# Altium schematic sheet Sheet1.SchDoc
size A
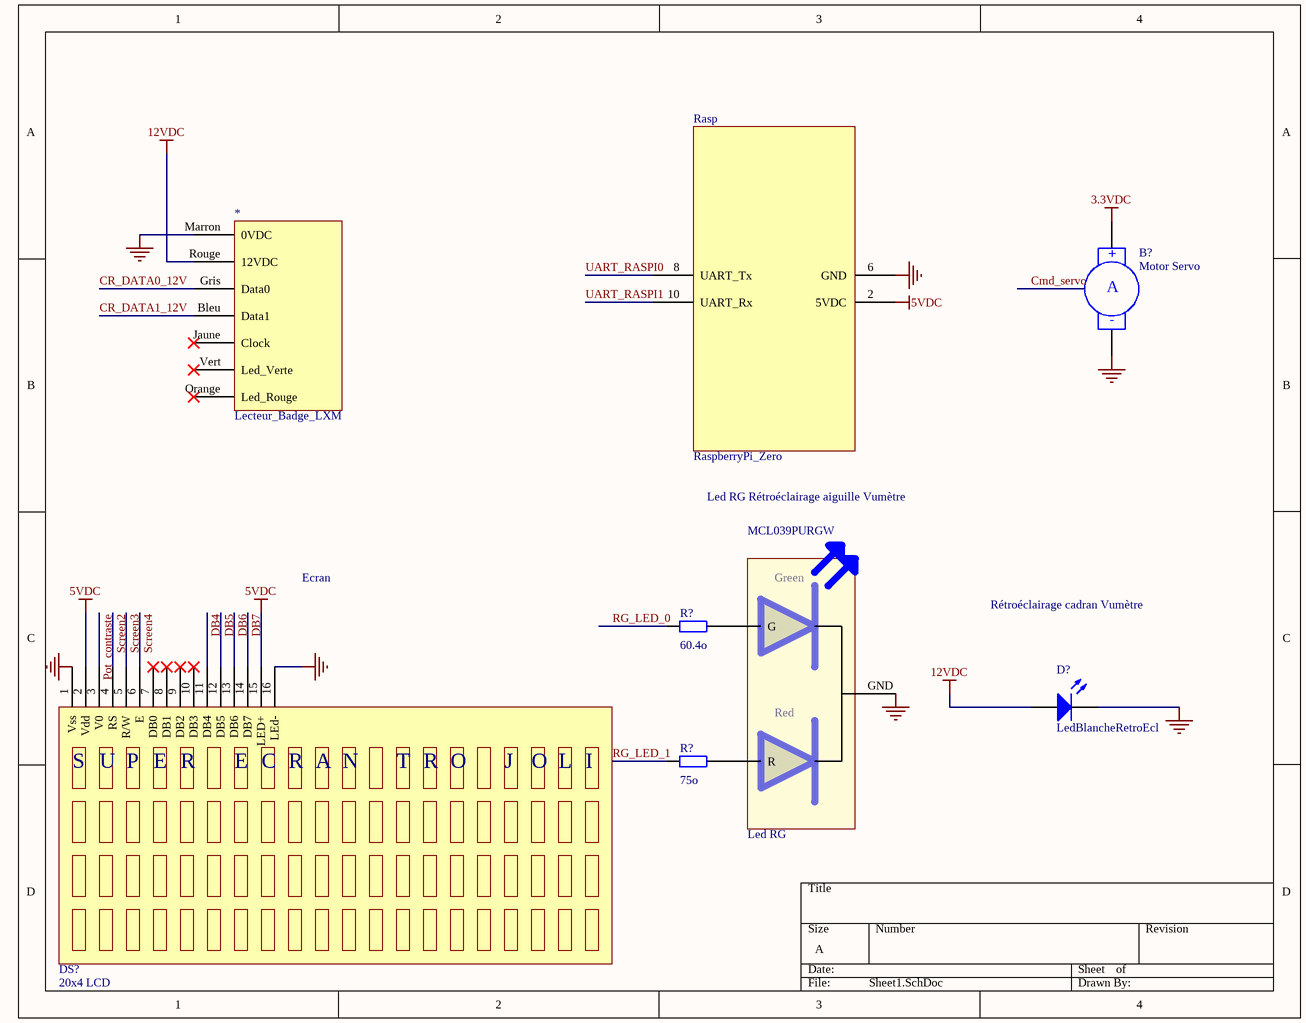
[diagram p0: Sheet1.SchDoc]

## Parts
(Parts that share a designator on the sheet are numbered #1, #2 ... from top to bottom, then left to right.)
*  Lecteur_Badge_LXM
B?  Motor Servo  [RAD-0.4]
D?  LedBlancheRetroEcl  [LED-0]
DS?  20x4 LCD
MCL039PURGW  Led RG
R?#1  value 60.4o  [AXIAL-0.4]  (hidden comment: Res2)
R?#2  value 75o  [AXIAL-0.4]  (hidden comment: Res2)
Rasp  RaspberryPi_Zero

## Nets
3.3VDC: B?.1(+)
5VDC: DS?.2(Vdd) DS?.15(LED+) Rasp.2(5VDC)
12VDC: *.Rouge(12VDC) D?.1(A)
GND: *.Marron(0VDC) B?.2(-) D?.2(K) DS?.1(Vss) DS?.16(LEd-) MCL039PURGW.GND Rasp.6(GND)
CR_DATA0_12V: *.Gris(Data0)
CR_DATA1_12V: *.Bleu(Data1)
DB4: DS?.11(DB4)
DB5: DS?.12(DB5)
DB6: DS?.13(DB6)
DB7: DS?.14(DB7)
Pot_contraste: DS?.3(V0)
RG_LED_0: R?#1.1
RG_LED_1: R?#2.1
Screen2: DS?.4(RS)
Screen3: DS?.5(R/W)
Screen4: DS?.6(E)
UART_RASPI0: Rasp.8(UART_Tx)
UART_RASPI1: Rasp.10(UART_Rx)
NetMCL039PURGW_G: MCL039PURGW.G R?#1.2
NetMCL039PURGW_R: MCL039PURGW.R R?#2.2

Not connected (* = marked no-connect by the designer): * Jaune(Clock)* Orange(Led_Rouge)* Vert(Led_Verte)*; DS? 7(DB0)* 8(DB1)* 9(DB2)* 10(DB3)*

## Notes on the sheet
- Led RG Rétroéclairage aiguille Vumètre
- Ecran
- Rétroéclairage cadran Vumètre
- (in symbol MC42008A6W-FPTLW) S; U; P; R; C; A; N; T; O; J; L; I
- (in symbol MCL039PURGW) Green; Red
- (in symbol Motor Servo) A

## Library data of the parts
* = Lecteur_Badge_LXM: Fournisseur: Gregoire; Fabricant: Stid-Security; Ref.Fournisseur: :); Ref.Fabricant: LXM_WIEGAND44b
B? = Motor Servo: Servo Motor; Published: 24-Mar-1999; LatestRevisionDate: 17-Jul-2002; LatestRevisionNote: Re-released for DXP Platform.; PackageReference: RAD-0.4; Publisher: Altium Limited; PackageDescription: Radial Cap, Thru-Hole; 2 Leads; 0.4 in Pin Spacing
D? = LED0: LED Blanche retro vumetre; Fournisseur: BARBIE; Fabricant: N/A; Ref.Fabricant: N/A; Ref.Fournisseur: N/A
DS? = MC42008A6W-FPTLW: Fournisseur: Farnell; Ref.Fournisseur: 2606880; Fabricant: Midas; Ref.Fabricant: MC42008A6W-FPTLW
MCL039PURGW = MCL039PURGW: Fournisseur: Farnell; Fabricant: Multicomp; Ref.Fournisseur: 1581194; Ref.Fabricant: MCL039PURGW
R?#1 R?#2 = Res2: Resistor; Fournisseur: Farnell; Fabricant: TE CONNECTIVITY; Ref.Fabricant: CPF0805B75RE1; Ref.Fournisseur: 1697415